# Altium schematic sheet Sheet1.SchDoc
size A4
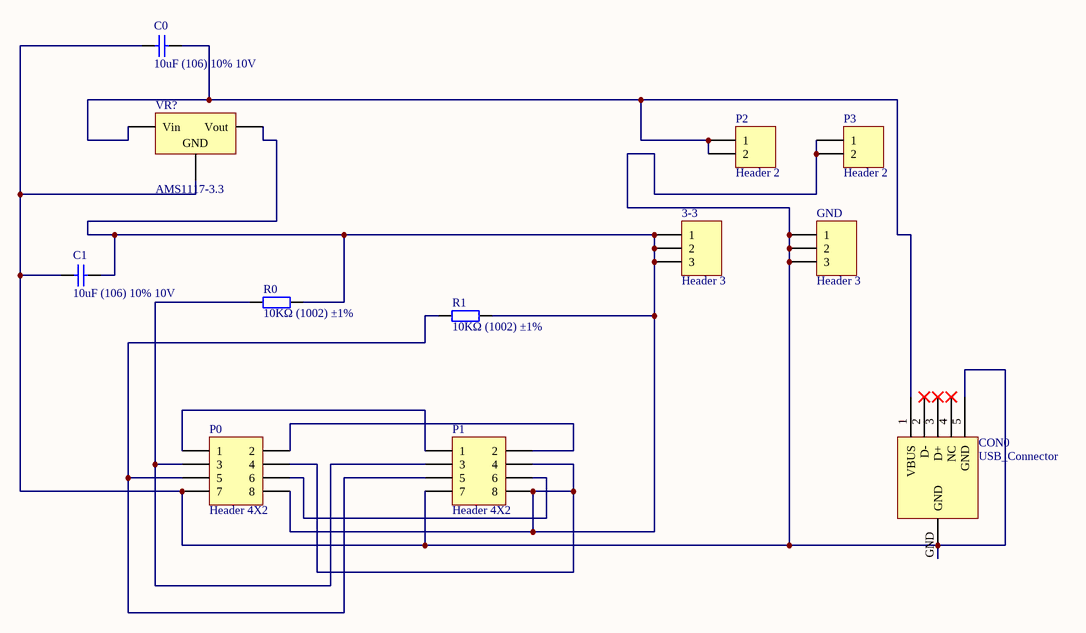
[diagram p0: Sheet1.SchDoc]

## Parts
3-3  Header 3  [HDR1X3]
C0  10uF (106) 10% 10V  [LC-0603_C]
C1  10uF (106) 10% 10V  [LC-0603_C]
CON0  USB_Connector  [MicroUSB]
GND  Header 3  [HDR1X3]
P0  Header 4X2  [HDR2X4]
P1  Header 4X2  [HDR2X4]
P2  Header 2  [HDR1X2]
P3  Header 2  [HDR1X2]
R0  10KΩ (1002) ±1%  [LC-0805_R]
R1  10KΩ (1002) ±1%  [LC-0805_R]
VR?  AMS1117-3.3  [LC-SOT-223]

## Nets
Net3-3_1: 3-3.1 3-3.2 3-3.3 C1.2 P0.4 P0.8 P1.4 P1.8 R0.2 R1.2 VR?.2(Vout)
NetC0_1: C0.1 C1.1 CON0.5(GND) CON0.GND GND.1 GND.2 GND.3 P0.7 P1.7 P3.1 P3.2 VR?.1(GND)
NetC0_2: C0.2 CON0.1(VBUS) P2.1 P2.2 VR?.3(Vin)
NetP0_1: P0.1 P1.1
NetP0_2: P0.2 P1.2
NetP0_3: P0.3 P1.3 R0.1
NetP0_5: P0.5 P1.5 R1.1
NetP0_6: P0.6 P1.6

Not connected (* = marked no-connect by the designer): CON0 2(D-)* 3(D+)* 4(NC)*

## Library data of the parts
3-3 GND = Header 3: Header, 3-Pin; LatestRevisionDate: 17-Jul-2002; LatestRevisionNote: Re-released for DXP Platform.; Publisher: Altium Limited
C0 C1 = 0603 10uF (106) 10% 10V: 贴片电容; ComponentLink1Description: 供应商链接; ComponentLink1URL: http://www.szlcsc.com/product/details_20411.html; Package: 0603; Supplier: LC; SuppliersPartNumber: C19702
P0 P1 = Header 4X2: Header, 4-Pin, Dual row; LatestRevisionDate: 17-Jul-2002; LatestRevisionNote: Re-released for DXP Platform.; Publisher: Altium Limited
P2 P3 = Header 2: Header, 2-Pin; LatestRevisionDate: 17-Jul-2002; LatestRevisionNote: Re-released for DXP Platform.; Publisher: Altium Limited
R0 R1 = 0805 10KΩ (1002) 1%: 贴片电阻; ComponentLink1Description: 供应商链接; ComponentLink1URL: http://www.szlcsc.com/product/details_18102.html; Package: 0805; Supplier: LC; SuppliersPartNumber: C17414
VR? = SOT-223 AMS1117-3.3: 低压差线性稳压(LDO); ComponentLink1Description: 供应商链接; ComponentLink1URL: http://www.szlcsc.com/product/details_6652.html; Package: SOT-223; Supplier: LC; SuppliersPartNumber: C6186